# Altium schematic sheet 03_GAP_MEM.SchDoc: SENSEI Base Board - GAP Memory
size A3; DrawnBy: Sebastian Frey; Organization: Integrated Systems Laboratory; DocumentNumber: 4; Revision: v1.1; SheetNumber: 4; SheetTotal: 12
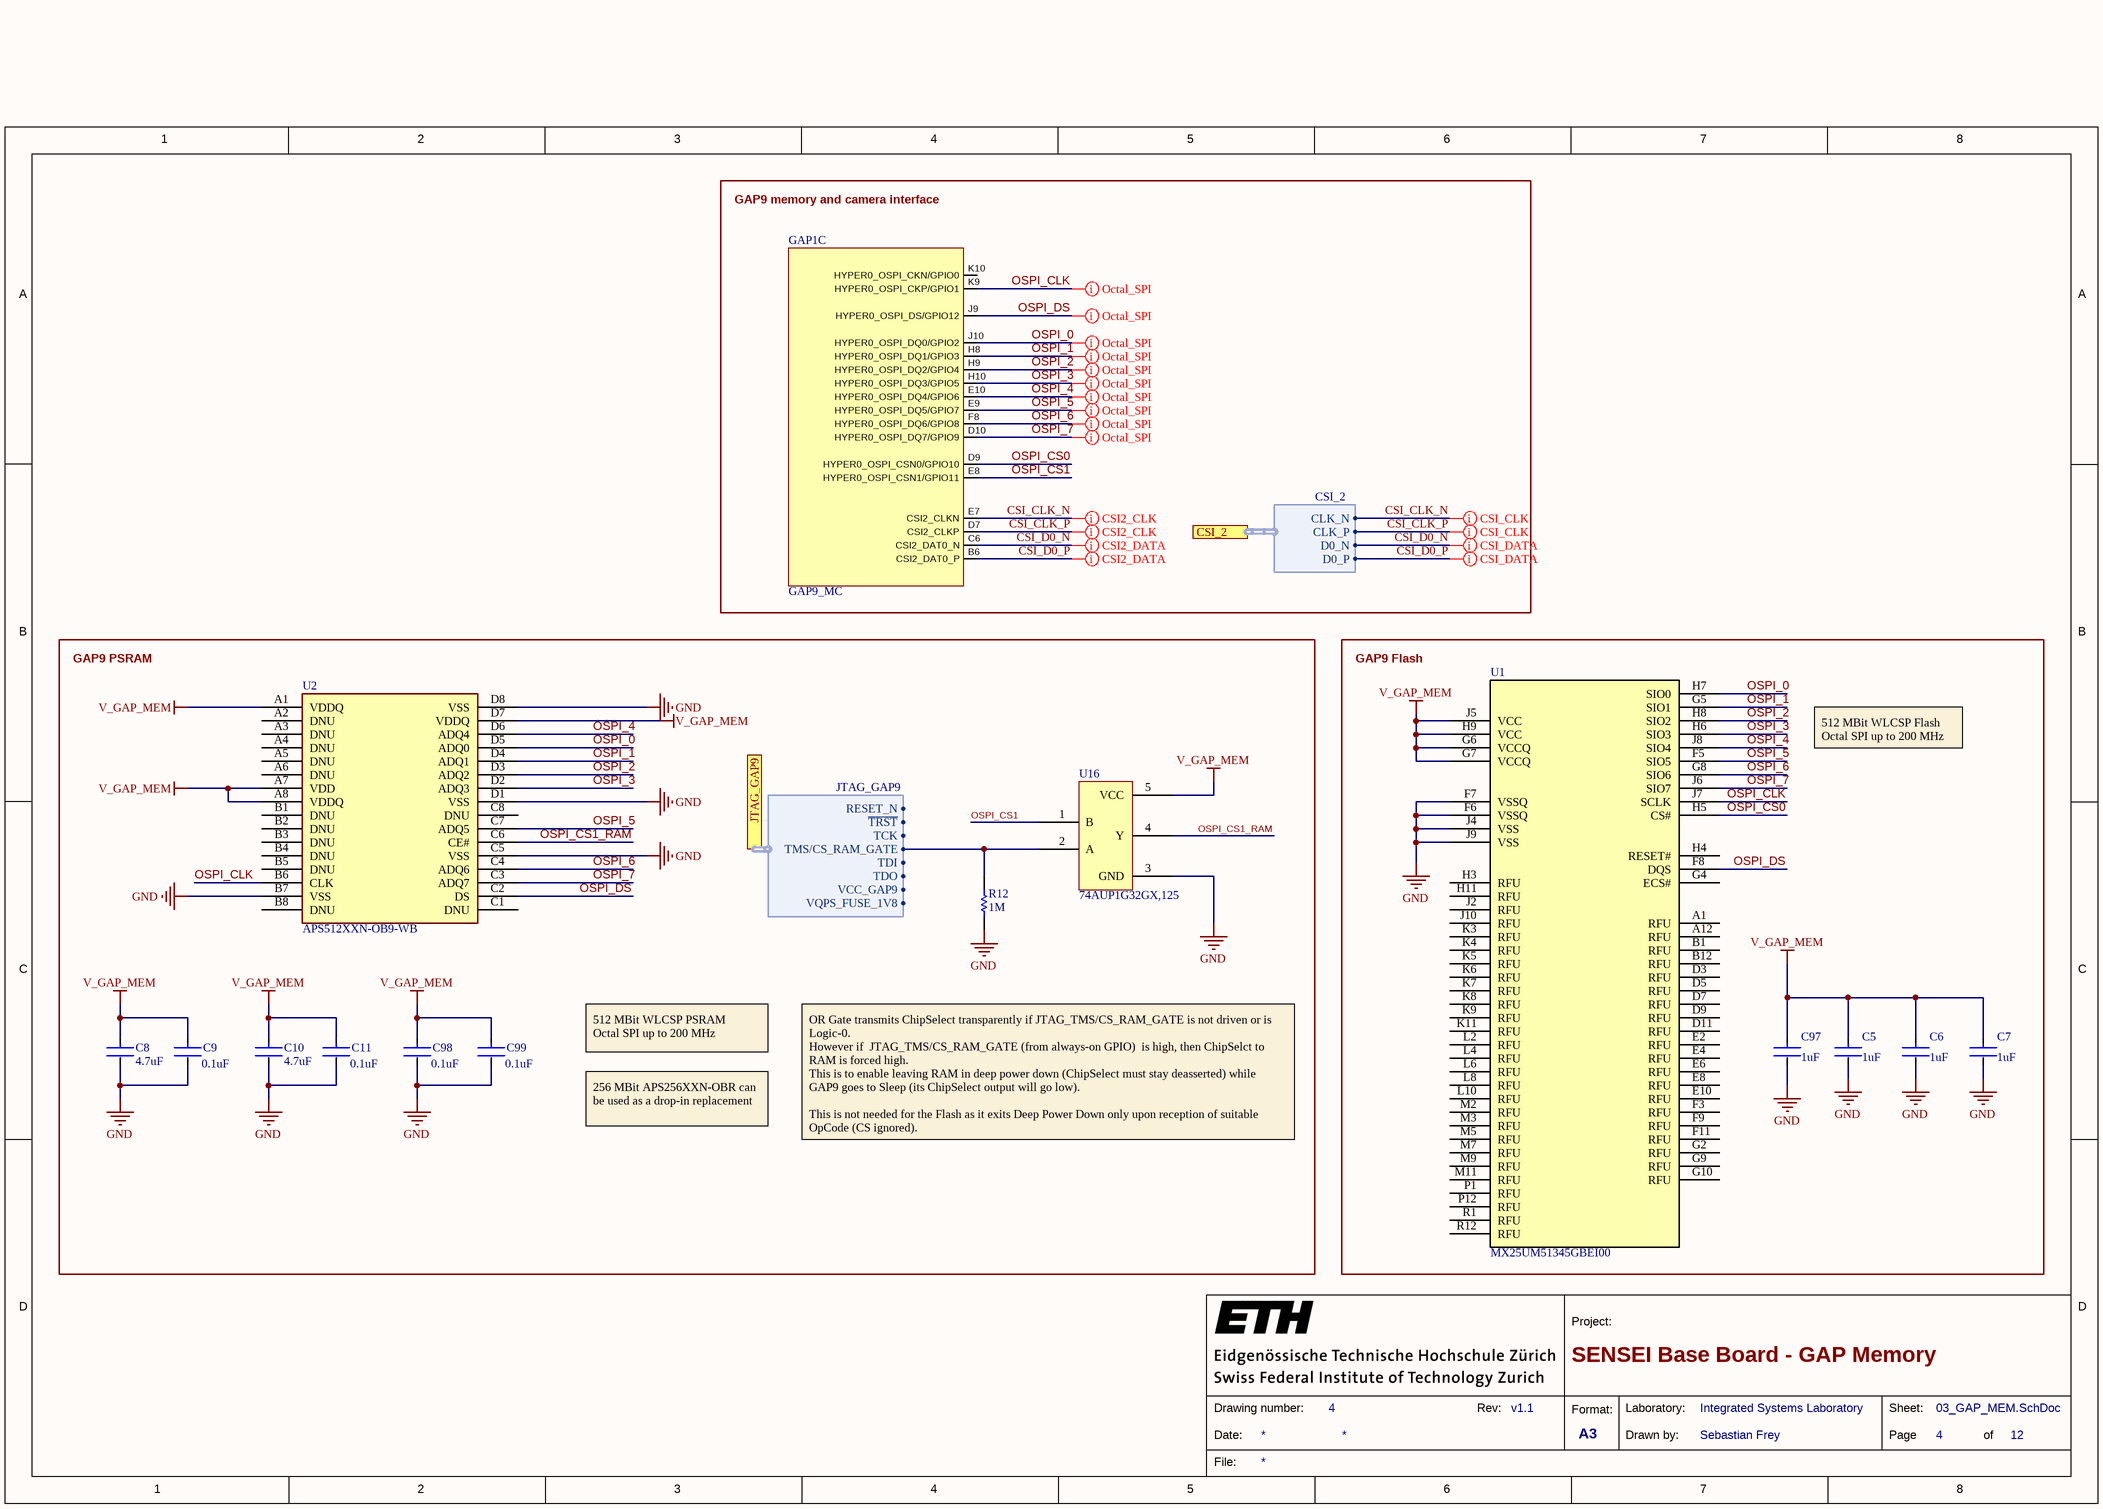
[diagram p0: 03_GAP_MEM.SchDoc]

## Parts
C5  Capacitance: 1uF  [FP-CL03-IPC_C]  (hidden comment: CL03A105KP3NSNC)
C6  Capacitance: 1uF  [FP-CL03-IPC_C]  (hidden comment: CL03A105KP3NSNC)
C7  Capacitance: 1uF  [FP-CL03-IPC_C]  (hidden comment: CL03A105KP3NSNC)
C8  Capacitance: 4.7uF  [FP-C1005-050-0_15-IPC_C]  (hidden comment: C1005X5R0J475K050BC)
C9  Capacitance: 0.1uF  [FP-GRM033-0_03-IPC_C]  (hidden comment: GRM033Z71C104KE14D)
C10  Capacitance: 4.7uF  [FP-C1005-050-0_15-IPC_C]  (hidden comment: C1005X5R0J475K050BC)
C11  Capacitance: 0.1uF  [FP-GRM033-0_03-IPC_C]  (hidden comment: GRM033Z71C104KE14D)
C97  Capacitance: 1uF  [FP-CL03-IPC_C]  (hidden comment: CL03A105KP3NSNC)
C98  Capacitance: 0.1uF  [FP-GRM033-0_03-IPC_C]  (hidden comment: GRM033Z71C104KE14D)
C99  Capacitance: 0.1uF  [FP-GRM033-0_03-IPC_C]  (hidden comment: GRM033Z71C104KE14D)
GAP1  GAP9_MC  [GAP9]  (part C of 5)
R12  value 1M  [RESC0201(0603)_L]  (hidden comment: ERJ-1GNJ105C)
U1  MX25UM51345GBEI00  [MX25UM51345GBEI00]
U2  APS512XXN-OB9-WB  [WLCSP32_APS512XXN-OB9-WB]
U16  74AUP1G32GX,125  [SOT1226-3]

## Blocks framed on the sheet
GAP9 memory and camera interface: GAP1
GAP9 PSRAM: C8-C11 C98 C99 R12 U2 U16
GAP9 Flash: C5-C7 C97 U1

## Ports
CSI_2 (harness CSI_2), JTAG_GAP9 (harness JTAG_GAP9)

## Harnesses
CSI_2: CLK_N, CLK_P, D0_P, D0_N
JTAG_GAP9: ~{TRST}, TCK, TMS/CS_RAM_GATE, TDI, TDO, VCC_GAP9, RESET_N, VQPS_FUSE_1V8

## Nets
GND: C5.2 C6.2 C7.2 C8.2 C9.2 C10.2 C11.2 C97.2 C98.2 C99.2 R12.1 U1.F6(VSSQ) U1.F7(VSSQ) U1.J4(VSS) U1.J9(VSS) U2.B7(VSS) U2.C5(VSS) U2.D1(VSS) U2.D8(VSS) U16.3(GND)
V_GAP_MEM: C5.1 C6.1 C7.1 C8.1 C9.1 C10.1 C11.1 C97.1 C98.1 C99.1 U1.G6(VCCQ) U1.G7(VCCQ) U1.H9(VCC) U1.J5(VCC) U2.A1(VDDQ) U2.A7(VDD) U2.A8(VDDQ) U2.D7(VDDQ) U16.5(VCC)
CSI_CLK_N: GAP1.E7(CSI2_CLKN) ; port CSI_2.CLK_N
CSI_CLK_P: GAP1.D7(CSI2_CLKP) ; port CSI_2.CLK_P
CSI_D0_N: GAP1.C6(CSI2_DAT0_N) ; port CSI_2.D0_N
CSI_D0_P: GAP1.B6(CSI2_DAT0_P) ; port CSI_2.D0_P
OSPI_0: GAP1.J10(HYPER0_OSPI_DQ0/GPIO2) U1.H7(SIO0) U2.D5(ADQ0)
OSPI_1: GAP1.H8(HYPER0_OSPI_DQ1/GPIO3) U1.G5(SIO1) U2.D4(ADQ1)
OSPI_2: GAP1.H9(HYPER0_OSPI_DQ2/GPIO4) U1.H8(SIO2) U2.D3(ADQ2)
OSPI_3: GAP1.H10(HYPER0_OSPI_DQ3/GPIO5) U1.H6(SIO3) U2.D2(ADQ3)
OSPI_4: GAP1.E10(HYPER0_OSPI_DQ4/GPIO6) U1.J8(SIO4) U2.D6(ADQ4)
OSPI_5: GAP1.E9(HYPER0_OSPI_DQ5/GPIO7) U1.F5(SIO5) U2.C7(ADQ5)
OSPI_6: GAP1.F8(HYPER0_OSPI_DQ6/GPIO8) U1.G8(SIO6) U2.C4(ADQ6)
OSPI_7: GAP1.D10(HYPER0_OSPI_DQ7/GPIO9) U1.J6(SIO7) U2.C3(ADQ7)
OSPI_CLK: GAP1.K9(HYPER0_OSPI_CKP/GPIO1) U1.J7(SCLK) U2.B6(CLK)
OSPI_CS0: GAP1.D9(HYPER0_OSPI_CSN0/GPIO10) U1.H5(CS#)
OSPI_CS1: GAP1.E8(HYPER0_OSPI_CSN1/GPIO11) U16.1(B)
OSPI_CS1_RAM: U2.C6(CE#) U16.4(Y)
OSPI_DS: GAP1.J9(HYPER0_OSPI_DS/GPIO12) U1.F8(DQS) U2.C2(DS)
NetR12_2: R12.2 U16.2(A) ; port JTAG_GAP9.TMS/CS_RAM_GATE

Not connected (* = marked no-connect by the designer): GAP1 K10(HYPER0_OSPI_CKN/GPIO0); U1 A1(RFU) A12(RFU) B1(RFU) B12(RFU) D3(RFU) D5(RFU) D7(RFU) D9(RFU) D11(RFU) E2(RFU) E4(RFU) E6(RFU) E8(RFU) E10(RFU) F3(RFU) F9(RFU) F11(RFU) G2(RFU) G4(ECS#) G9(RFU) G10(RFU) H3(RFU) H4(RESET#) H11(RFU) J2(RFU) J10(RFU) K3(RFU) K4(RFU) K5(RFU) K6(RFU) K7(RFU) K8(RFU) K9(RFU) K11(RFU) L2(RFU) L4(RFU) L6(RFU) L8(RFU) L10(RFU) M2(RFU) M3(RFU) M5(RFU) M7(RFU) M9(RFU) M11(RFU) P1(RFU) P12(RFU) R1(RFU) R12(RFU); U2 A2(DNU) A3(DNU) A4(DNU) A5(DNU) A6(DNU) B1(DNU) B2(DNU) B3(DNU) B4(DNU) B5(DNU) B8(DNU) C1(DNU) C8(DNU)

## Layout directives
net class CSI2_CLK: CSI_CLK_N, CSI_CLK_P
net class CSI2_DATA: CSI_D0_N, CSI_D0_P
differential pair: CSI_CLK_N, CSI_CLK_P, CSI_D0_N, CSI_D0_P
net class O_SPI: OSPI_0, OSPI_1, OSPI_2, OSPI_3, OSPI_4, OSPI_5, OSPI_6, OSPI_7, OSPI_CLK, OSPI_DS

## Notes on the sheet
- 512 MBit WLCSP Flash
  Octal SPI up to 200 MHz
- 512 MBit WLCSP PSRAM
  Octal SPI up to 200 MHz
- 256 MBit APS256XXN-OBR can be used as a drop-in replacement
- OR Gate transmits ChipSelect transparently if JTAG_TMS/CS_RAM_GATE is not driven or is Logic-0.
  However if  JTAG_TMS/CS_RAM_GATE (from always-on GPIO)  is high, then ChipSelct to RAM is forced high.
  This is to enable leaving RAM in deep power down (ChipSelect must stay deasserted) while GAP9 goes to Sleep (its ChipSelect output will go low).
  This is not needed for the Flash as it exits Deep Power Down only upon reception of suitable OpCode (CS ignored).
- 1
- 2
- 3
- 4
- 5
- 6
- 7
- 8
- A
- B
- C
- D
- Project:
- Date:
- Drawing number:
- Rev:
- Format:
- A3
- Drawn by:
- Laboratory:
- Page
- Sheet:
- of
- File:

## Library data of the parts
C5-C7 C97 = CMP-13271-003594-1: Cap Ceramic 1uF 10V X5R ±10% Pad SMD 0201 +85°C T/R; Min Operating Temperature: -55°C; Mount: Surface Mount; Packaging: Cut Tape; Width: 0.012inch; Tolerance: 10%; Case Code (Imperial): 0201; Thickness: 0.013inch; Length: 0.024inch; Case/Package: 0201; Max Operating Temperature: 85°C; Voltage Rating: 10V; Case Code (Metric): 0603
C8 C10 = CMP-2000-05437-2: CAP CER 4.7UF 6.3V X5R 0402; Tolerance: 10%; Dielectric Material: Ceramic; Voltage: 6.3V; Depth: 0.5mm; Height: 0.5mm; Length: 1mm; Termination: SMD/SMT; RoHS Compliant: Yes; Series: C; Case/Package: 0402; Dielectric: X5R; Lead Free: Lead Free; Mount: Surface Mount; Max Operating Temperature: 85°C; Min Operating Temperature: -55°C
C9 C11 C98 C99 = CMP-06035-035508-1: Chip Multilayer Ceramic Capacitors for General Purpose, 0201, 0.10uF, X7R, 15%, 10%, 16V; Case/Package: 0201
R12 = CMP-1010-00146-1: 1M 0.05W 5% 0201 (0603 Metric)  SMD; Case-Metric: 0603; Case-EIA: 0201; Technology: SMT; Tolerance: 5 %; Power: 0.05 W
U1 = MX25UM51345GBEI00: Macronix 512 Mbit WLCSP Flash
U2 = APS512XXN-OB9-WB: 512 Mbit octal SPI PSRAM APmemory; Copyright: Copyright (C) 2022 Ultra Librarian. All rights reserved.; Mfr_Name: AP Memory; Manufacturer_Part_Number: APS512XXN-OB9-WB; RefDes: RefDes; Type: DEV